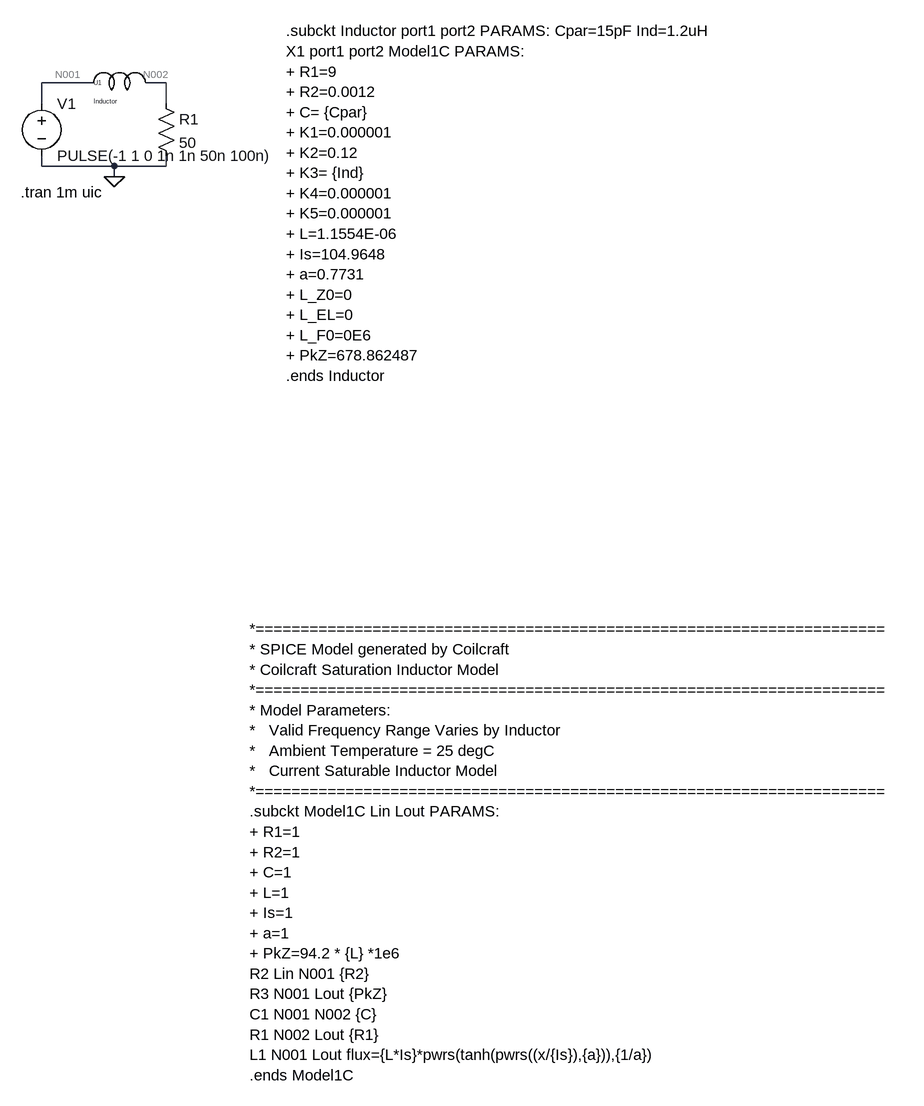
[diagram p0: schematic InSchematicSubCktExample.asc]
InSchematicSubCktExample.asc, the LTspice schematic file:
Version 4
SHEET 1 1796 1632
WIRE 192 160 112 160
WIRE 304 160 272 160
WIRE 112 192 112 160
WIRE 304 192 304 160
WIRE 112 288 112 272
WIRE 224 288 112 288
WIRE 304 288 304 272
WIRE 304 288 224 288
WIRE 224 304 224 288
FLAG 224 304 0
SYMBOL res 288 176 R0
SYMATTR InstName R1
SYMATTR Value 50
SYMBOL voltage 112 176 R0
WINDOW 123 0 0 Left 0
WINDOW 39 0 0 Left 0
SYMATTR InstName V1
SYMATTR Value PULSE(-1 1 0 1n 1n 50n 100n)
SYMBOL XAL1010_Mine 192 160 R0
WINDOW 38 40 -32 Invisible 2
WINDOW 0 0 0 Left 0
WINDOW 3 0 28 Left 0
SYMATTR SpiceModel ""
SYMATTR InstName U1
SYMATTR Value Inductor
TEXT 80 328 Left 2 !.tran 1m uic
TEXT 488 80 Left 2 !.subckt Inductor port1 port2 PARAMS: Cpar=15pF Ind=1.2uH\nX1 port1 port2 Model1C PARAMS:\n+ R1=9\n+ R2=0.0012\n+ C= {Cpar}\n+ K1=0.000001\n+ K2=0.12\n+ K3= {Ind}\n+ K4=0.000001\n+ K5=0.000001\n+ L=1.1554E-06\n+ Is=104.9648\n+ a=0.7731\n+ L_Z0=0\n+ L_EL=0\n+ L_F0=0E6\n+ PkZ=678.862487\n.ends Inductor
TEXT 432 1000 Left 2 !*======================================================================\n* SPICE Model generated by Coilcraft\n* Coilcraft Saturation Inductor Model\n*======================================================================\n* Model Parameters:\n*   Valid Frequency Range Varies by Inductor\n*   Ambient Temperature = 25 degC\n*   Current Saturable Inductor Model\n*======================================================================\n.subckt Model1C Lin Lout PARAMS:\n+ R1=1\n+ R2=1\n+ C=1\n+ L=1\n+ Is=1\n+ a=1\n+ PkZ=94.2 * {L} *1e6\nR2 Lin N001 {R2}\nR3 N001 Lout {PkZ}\nC1 N001 N002 {C}\nR1 N002 Lout {R1}\nL1 N001 Lout flux={L*Is}*pwrs(tanh(pwrs((x/{Is}),{a})),{1/a})\n.ends Model1C

The netlist it stands for:
* InSchematicSubCktExample.asc
R1 N002 0 50
V1 N001 0 PULSE(-1 1 0 1n 1n 50n 100n)
XU1 N001 N002 Inductor  ; pins port1 port2
.tran 1m uic
.subckt Inductor port1 port2 PARAMS: Cpar=15pF Ind=1.2uH
X1 port1 port2 Model1C PARAMS:
+ R1=9
+ R2=0.0012
+ C= {Cpar}
+ K1=0.000001
+ K2=0.12
+ K3= {Ind}
+ K4=0.000001
+ K5=0.000001
+ L=1.1554E-06
+ Is=104.9648
+ a=0.7731
+ L_Z0=0
+ L_EL=0
+ L_F0=0E6
+ PkZ=678.862487
.ends Inductor
*======================================================================
* SPICE Model generated by Coilcraft
* Coilcraft Saturation Inductor Model
*======================================================================
* Model Parameters:
*   Valid Frequency Range Varies by Inductor
*   Ambient Temperature = 25 degC
*   Current Saturable Inductor Model
*======================================================================
.subckt Model1C Lin Lout PARAMS:
+ R1=1
+ R2=1
+ C=1
+ L=1
+ Is=1
+ a=1
+ PkZ=94.2 * {L} *1e6
R2 Lin N001 {R2}
R3 N001 Lout {PkZ}
C1 N001 N002 {C}
R1 N002 Lout {R1}
L1 N001 Lout flux={L*Is}*pwrs(tanh(pwrs((x/{Is}),{a})),{1/a})
.ends Model1C
.backanno
.end